# Altium schematic sheet RTC.SchDoc
size A; SheetNumber: 6; SheetTotal: 13
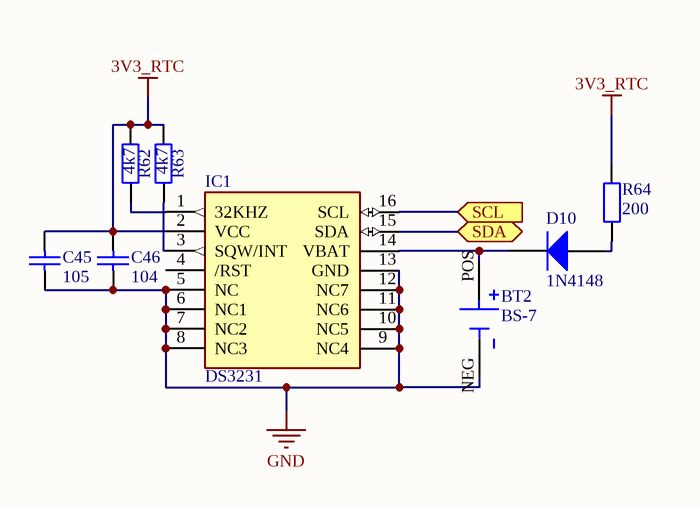
[diagram p0: RTC.SchDoc]

## Parts
BT2  BS-7  [BAT_BS-7]
C45  105  [0603_Cap]
C46  104  [0603_Cap]
D10  1N4148  [SOD-323]
IC1  DS3231  [SOIC-16]  (value not drawn)
R62  4k7  [0603_Res]
R63  4k7  [0603_Res]
R64  200  [0603_Res]

## Ports
SCL (in), SDA (bidir)

## Nets
3V3_RTC: C45.1 C46.1 IC1.2(VCC) R62.2 R63.2 R64.1
GND: BT2.NEG C45.2 C46.2 IC1.5(NC) IC1.6(NC1) IC1.7(NC2) IC1.8(NC3) IC1.9(NC4) IC1.10(NC5) IC1.11(NC6) IC1.12(NC7) IC1.13(GND)
SCL: IC1.16(SCL) ; port SCL
SDA: IC1.15(SDA) ; port SDA
NetBT2_POS: BT2.POS D10.1 IC1.14(VBAT)
NetD10_2: D10.2 R64.2
NetIC1_1: IC1.1(32KHZ) R62.1
NetIC1_3: IC1.3(SQW/INT) R63.1

Not connected (* = marked no-connect by the designer): IC1 4(/RST)

## Library data of the parts
BT2 = BS-7: Battery Holder (Open) Coin, 20.0mm 1 Cell PC Pin; MF: MPD (Memory; SnapEDA_Link: https://www.snapeda.com/parts/BS-7/MPD+%2528Memory+Protection+Devices%2529/view-part/?ref=snap; Package: None; MP: BS-7; Check_prices: https://www.snapeda.com/parts/BS-7/MPD+%2528Memory+Protection+Devices%2529/view-part/?ref=eda; Purchase-URL: https://pricing.snapeda.com/search/part/BS-7/?ref=eda; Digi-Key_Part_Number: BS-7-ND; Value: *
C45 C46 = Ceramic Capacitor: Chung_Loai: Dán; Don_Vi: Con; So_Chan: 2; Ten_Linh_Kien: Tụ 0805 104-100nF 10% 50V; Ma_Hang: MH004551; Kieu_Chan: *
D10 = Diode: Ten_Linh_Kien: Diode S4 SOD123 ( 1N5819 SOD123); Ma_Hang: MH005519; Chung_Loai: Dán; Don_Vi: Con; Ghi_Chu: *; Kieu_Chan: *
IC1 = DS3231: Real Time Clock (RTC) IC Clock/Calendar - IÂ²C, 2-Wire Serial 8-SOIC (0.154, 3.90mm Width); MF: Maxim Integrated; Check_prices: https://www.snapeda.com/parts/DS3231/Maxim+Integrated/view-part/?ref=eda; Value: *; Availability: In Stock; MP: DS3231; Price: None; Package: SOIC-16 Maxim Integrated; SnapEDA_Link: https://www.snapeda.com/parts/DS3231/Maxim+Integrated/view-part/?ref=snap; Purchase-URL: https://pricing.snapeda.com/search/part/DS3231/?ref=eda
R62-R64 = Resistor: Chung_Loai: Dán; Don_Vi: Con; So_Chan: 2; Ten_Linh_Kien: Trở 0805 1% 1k; Ma_Hang: MH005468; Kieu_Chan: *